# Altium schematic sheet pwm_outputs.SchDoc
size A3
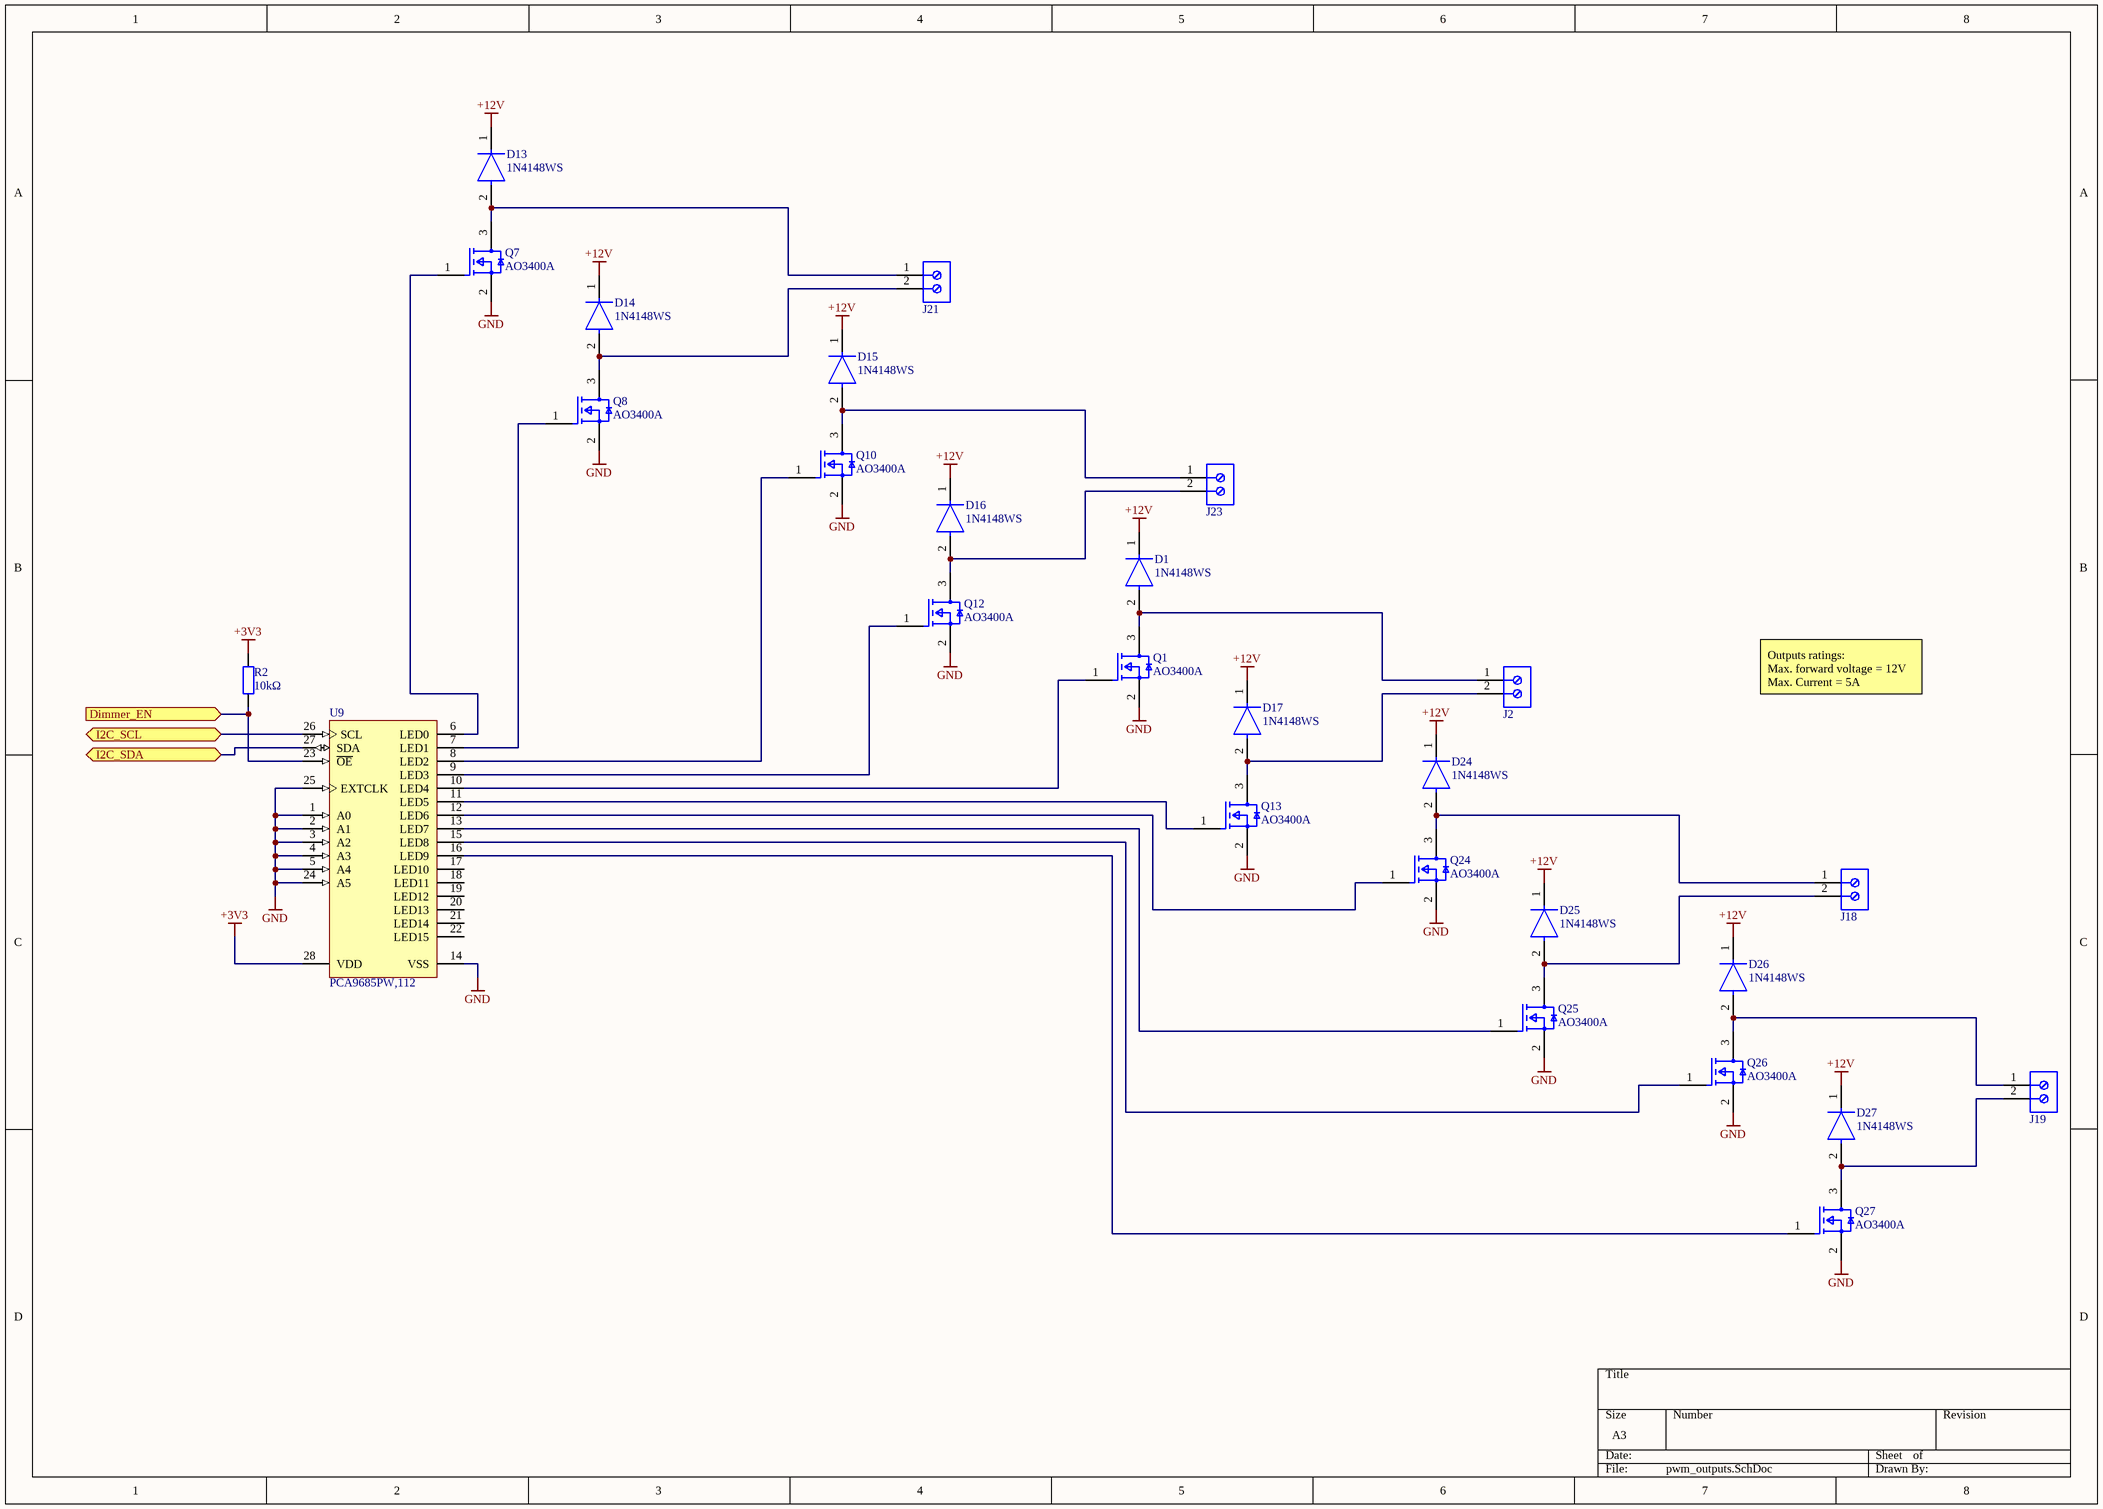
[diagram p0: pwm_outputs.SchDoc]

## Parts
D1  1N4148WS  [FP-477AB-IPC_C]
D13  1N4148WS  [FP-477AB-IPC_C]
D14  1N4148WS  [FP-477AB-IPC_C]
D15  1N4148WS  [FP-477AB-IPC_C]
D16  1N4148WS  [FP-477AB-IPC_C]
D17  1N4148WS  [FP-477AB-IPC_C]
D24  1N4148WS  [FP-477AB-IPC_C]
D25  1N4148WS  [FP-477AB-IPC_C]
D26  1N4148WS  [FP-477AB-IPC_C]
D27  1N4148WS  [FP-477AB-IPC_C]
J2  282836-2  [TECO-282836-2_V]  (value not drawn)
J18  282836-2  [TECO-282836-2_V]  (value not drawn)
J19  282836-2  [TECO-282836-2_V]  (value not drawn)
J21  282836-2  [TECO-282836-2_V]  (value not drawn)
J23  282836-2  [TECO-282836-2_V]  (value not drawn)
Q1  AO3400A  [SOT-23]
Q7  AO3400A  [SOT-23]
Q8  AO3400A  [SOT-23]
Q10  AO3400A  [SOT-23]
Q12  AO3400A  [SOT-23]
Q13  AO3400A  [SOT-23]
Q24  AO3400A  [SOT-23]
Q25  AO3400A  [SOT-23]
Q26  AO3400A  [SOT-23]
Q27  AO3400A  [SOT-23]
R2  10kΩ  [RESC2013X50X30ML20T20]
U9  PCA9685PW,112  [SOT361-1_V]

## Ports
Dimmer_EN (in), I2C_SCL (bidir), I2C_SDA (bidir)

## Nets
+3V3: R2.2 U9.28(VDD)
+12V: D1.1(C) D13.1(C) D14.1(C) D15.1(C) D16.1(C) D17.1(C) D24.1(C) D25.1(C) D26.1(C) D27.1(C)
GND: Q1.2(S) Q7.2(S) Q8.2(S) Q10.2(S) Q12.2(S) Q13.2(S) Q24.2(S) Q25.2(S) Q26.2(S) Q27.2(S) U9.1(A0) U9.2(A1) U9.3(A2) U9.4(A3) U9.5(A4) U9.14(VSS) U9.24(A5) U9.25(EXTCLK)
Dimmer_EN: R2.1 U9.23(~{OE}) ; port Dimmer_EN
I2C_SCL: U9.26(SCL) ; port I2C_SCL
I2C_SDA: U9.27(SDA) ; port I2C_SDA
NetD1_2: D1.2(A) J2.1 Q1.3(D)
NetD13_2: D13.2(A) J21.1 Q7.3(D)
NetD14_2: D14.2(A) J21.2 Q8.3(D)
NetD15_2: D15.2(A) J23.1 Q10.3(D)
NetD16_2: D16.2(A) J23.2 Q12.3(D)
NetD17_2: D17.2(A) J2.2 Q13.3(D)
NetD24_2: D24.2(A) J18.1 Q24.3(D)
NetD25_2: D25.2(A) J18.2 Q25.3(D)
NetD26_2: D26.2(A) J19.1 Q26.3(D)
NetD27_2: D27.2(A) J19.2 Q27.3(D)
NetQ1_1: Q1.1(G) U9.10(LED4)
NetQ7_1: Q7.1(G) U9.6(LED0)
NetQ8_1: Q8.1(G) U9.7(LED1)
NetQ10_1: Q10.1(G) U9.8(LED2)
NetQ12_1: Q12.1(G) U9.9(LED3)
NetQ13_1: Q13.1(G) U9.11(LED5)
NetQ24_1: Q24.1(G) U9.12(LED6)
NetQ25_1: Q25.1(G) U9.13(LED7)
NetQ26_1: Q26.1(G) U9.15(LED8)
NetQ27_1: Q27.1(G) U9.16(LED9)

Not connected (* = marked no-connect by the designer): U9 17(LED10) 18(LED11) 19(LED12) 20(LED13) 21(LED14) 22(LED15)

## Notes on the sheet
- Outputs ratings:
  Max. forward voltage = 12V
  Max. Current = 5A

## Library data of the parts
D1 D13-D17 D24-D27 = CMP-07163-000040-1: DIODE GEN PURP 75V 150MA SOD323F; Forward Voltage: 1V; Power Dissipation: 200mW; Element Configuration: Single; Max Forward Surge Current (Ifsm): 2A; Peak Reverse Current: 5uA; Recovery Time: 4ns; Package Quantity: 1; Number of Pins: 2; Height: 1mm; REACH SVHC: No SVHC; Max Reverse Voltage (DC): 75V; Forward Current: 150mA; Length: 1.8mm; Max Repetitive Reverse Voltage (Vrrm): 75V; Max Operating Temperature: 150°C; Average Rectified Current: 150mA; Contact Plating: Tin; Packaging: Tape and Reel; Radiation Hardening: No; Min Operating Temperature: -55°C; Width: 1.35mm; Weight: 0.0276g; Lead Free: Lead Free; Mount: Surface Mount; Reverse Voltage: 75V; Reverse Recovery Time: 4ns
J2 J18 J19 J21 J23 = CMP-1684-00017-1: Female Header, Pitch 5 mm, 1 x 2 Position, Height 10 mm, Tail Length 3.5 mm, Rohs, Bulk; Manufacturer: TE Connectivity; Wire Gauge: 16-30AWG; Product Training Modules: Wire-to-BoardEurostyleTerminalBlocks; Clamp Material - Plating: Brass-NickelPlated; Voltage: 300V; Mating Orientation: HorizontalwithBoard; Current: 13.5A; Pitch: 0.197"(5.00mm); Screw Thread: M3; 3D Model: 282836-2.pdf; Other Names: 5ULV-02B / A98076; Dynamic Catalog: BuchananSeries; Number of Levels: 1; Torque - Screw: 0.68Nm(6Lb-In); Featured Product: EurostyleTerminalBlockConnectors; Positions Per Level: 2; Wire Termination: Screw-RisingCageClamp; Datasheet URL: http://www.te.com.cn/commerce/DocumentDelivery/DDEController?Action=showdoc&DocId=Catalog+Section%7F1308389_EUROSTYLE_TERMINAL_BLOCKS%7F0607%7Fpdf%7FEnglish%7FENG_CS_1308389_EUROSTYLE_TERMINAL_BLOCKS_0607.pdf%7F282836-2; Color: Green; Family: TerminalBlocks-WiretoBoard; RoHS Information: 282836-2StatementofCompliance; Standard Package: 300; Contact Material - Plating: Brass-TinPlated; Manufacturer URL: http://www.te.com; Housing Material: Polyamide(PA66),Nylon6/6; Features: Interlocking(Side); Package Description: Female Header, Pitch 5 mm, 1 x 2 Position, Height 10 mm, Tail Length 3.5 mm; Mounting Type: ThroughHole; Package Reference: THD; Packaging: Bulk; Series: Buchanan; Category: Connectors,Interconnects; Screw Material - Plating: Brass-NickelPlated
Q1 Q7 Q8 Q10 Q12 Q13 Q24-Q27 = MOSFET_AO3400A: MOSFET N-CH 30V 5.7A SOT23; Input Capacitance: 630pF; Number of Elements: 1; Rds On Max: 26.5mR; Max Power Dissipation: 1.4W; Gate to Source Voltage (Vgs): 12V; Min Operating Temperature: -55°C; Lead Free: Lead Free; Number of Pins: 3; Drain to Source Voltage (Vdss): 30V; Case/Package: SOT-23; Mount: Surface Mount; Continuous Drain Current (ID): 5.7A; Radiation Hardening: No; Packaging: Tape and Reel; Max Operating Temperature: 150°C; Power Dissipation: 1.4W
R2 = Res_0805: Resistor
U9 = CMP-1595-00004-2: 16-Channel, 12-Bit PWM Fm+ I2C-Bus LED Controller, 2.3 to 5.5 V, -40 to 85 degC, 28-Pin TSSOP (SOT361-1), RoHS, Tape and Reel; Supply Current Max: 10 mA; Supply Voltage Min: 2.3 V; Supply Voltage Max: 5.5 V; Frequency: 25000000 Hz; Temperature Min: -40 degC; PackageDescription: 28-Pin Small Outline Package, Body 9.7 x 4.4 mm, Pitch 0.65 mm; RoHS: TRUE; ComponentLink1Description: Manufacturer URL; Code_JEDEC: MO-153; PartNumber: PCA9685; ComponentLink2URL: http://www.nxp.com/documents/data_sheet/PCA9685.pdf; Packing: Tape and Reel; ComponentLink1URL: http://www.nxp.com/; ComponentLink3Description: Package Specification; ComponentLink2Description: Datasheet; ComponentLink3URL: http://www.nxp.com/documents/outline_drawing/sot361-1_po.pdf; DatasheetVersion: Rev. 4; Temperature Max: 85 degC; PackageVersion: 02/2003; Mounting Technology: Surface Mount